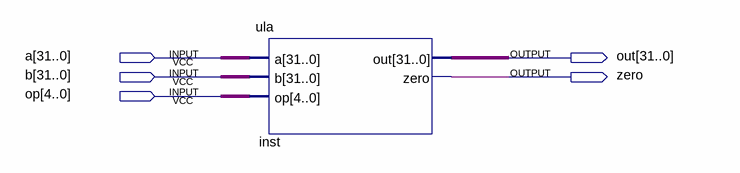
[diagram p0: schematic sheet]
// Quartus schematic teste_ula.bdf as structural Verilog: 1 symbols, 5 pins
module teste_ula (
  input  [31:0] a,
  input  [31:0] b,
  input  [4:0] op,
  output [31:0] out,
  output zero
);

  ula inst (.a(a), .b(b), .op(op), .out(out), .zero(zero));
endmodule
